# Altium schematic sheet Cores.SchDoc
size A4; DocumentNumber: 7; SheetNumber: 7; SheetTotal: 29
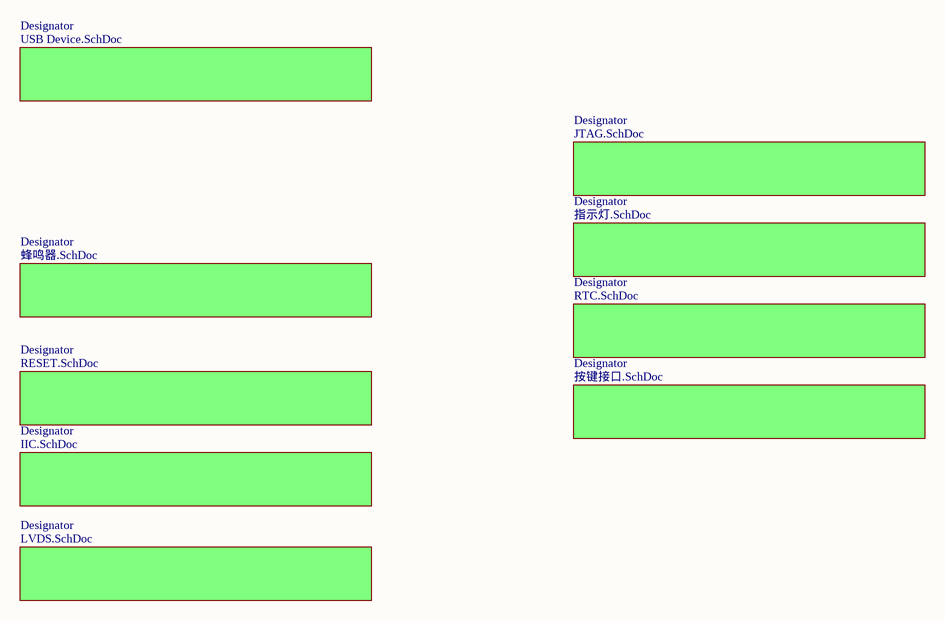
[diagram p0: Cores.SchDoc]

## Sub-sheets
Designator = JTAG.SchDoc: no entries
Designator = RTC.SchDoc: no entries
Designator = 按键接口.SchDoc: no entries
Designator = 指示灯.SchDoc: no entries
Designator = IIC.SchDoc: no entries
Designator = RESET.SchDoc: no entries
Designator = USB Device.SchDoc: no entries
Designator = 蜂鸣器.SchDoc: no entries
Designator = LVDS.SchDoc: no entries